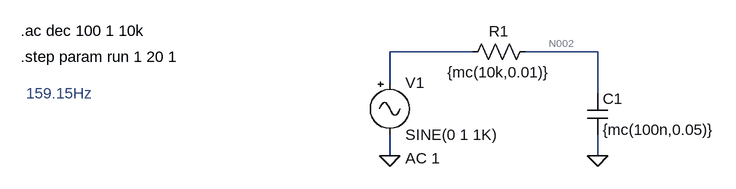
[diagram p0: schematic Monte Carlo.asc]
Monte Carlo.asc, the LTspice schematic file:
Version 4
SHEET 1 880 680
WIRE -48 96 -176 96
WIRE 144 96 32 96
WIRE -176 144 -176 96
WIRE 144 160 144 96
WIRE -176 256 -176 224
WIRE 144 256 144 224
FLAG -176 256 0
FLAG 144 256 0
SYMBOL Misc\\signal -176 128 R0
WINDOW 123 24 132 Left 2
WINDOW 39 0 0 Left 0
SYMATTR InstName V1
SYMATTR Value2 AC 1
SYMBOL res 48 80 R90
WINDOW 0 0 56 VBottom 2
WINDOW 3 32 56 VTop 2
SYMATTR InstName R1
SYMATTR Value {mc(10k,0.01)}
SYMBOL cap 128 160 R0
SYMATTR InstName C1
SYMATTR Value {mc(100n,0.05)}
TEXT -744 64 Left 2 !.ac dec 100 1 10k
TEXT -744 104 Left 2 !.step param run 1 20 1
TEXT -736 160 Left 2 ;159.15Hz

The netlist it stands for:
* Monte Carlo.asc
V1 N001 0 SINE(0 1 1K) AC 1
R1 N002 N001 {mc(10k,0.01)}
C1 N002 0 {mc(100n,0.05)}
.ac dec 100 1 10k
.step param run 1 20 1
* 159.15Hz
.backanno
.end

* Results of the author's LTspice run, read from the files saved beside the schematic
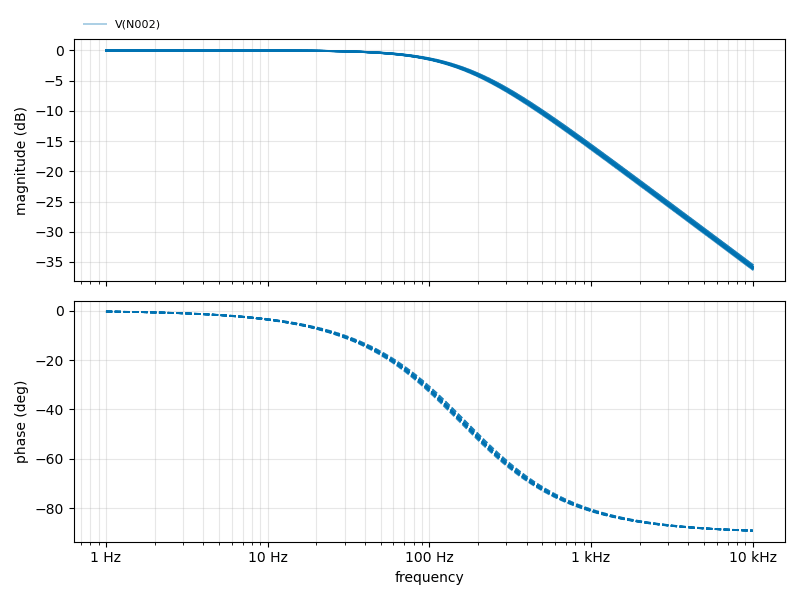
[diagram p1: AC Analysis of Monte Carlo.asc, plotted from the saved traces]
* AC Analysis, 20 runs:
*   V(N002) [run 1]: -0.00 dB at 1 Hz, -35.93 dB at 10 kHz, peak -0.00 dB at 1 Hz, 3 dB below the peak at 159.7 Hz
*   V(N002) [run 2]: -0.00 dB at 1 Hz, -36.18 dB at 10 kHz, peak -0.00 dB at 1 Hz, 3 dB below the peak at 155.3 Hz
*   V(N002) [run 3]: -0.00 dB at 1 Hz, -35.96 dB at 10 kHz, peak -0.00 dB at 1 Hz, 3 dB below the peak at 159.2 Hz
*   V(N002) [run 4]: -0.00 dB at 1 Hz, -36.28 dB at 10 kHz, peak -0.00 dB at 1 Hz, 3 dB below the peak at 153.5 Hz
*   V(N002) [run 5]: -0.00 dB at 1 Hz, -36.21 dB at 10 kHz, peak -0.00 dB at 1 Hz, 3 dB below the peak at 154.7 Hz
*   V(N002) [run 6]: -0.00 dB at 1 Hz, -36.01 dB at 10 kHz, peak -0.00 dB at 1 Hz, 3 dB below the peak at 158.3 Hz
*   V(N002) [run 7]: -0.00 dB at 1 Hz, -35.50 dB at 10 kHz, peak -0.00 dB at 1 Hz, 3 dB below the peak at 167.9 Hz
*   V(N002) [run 8]: -0.00 dB at 1 Hz, -35.77 dB at 10 kHz, peak -0.00 dB at 1 Hz, 3 dB below the peak at 162.7 Hz